# EAGLE design v5.3 (EAGLE 9.6.2)

## Sheet 1 of 5
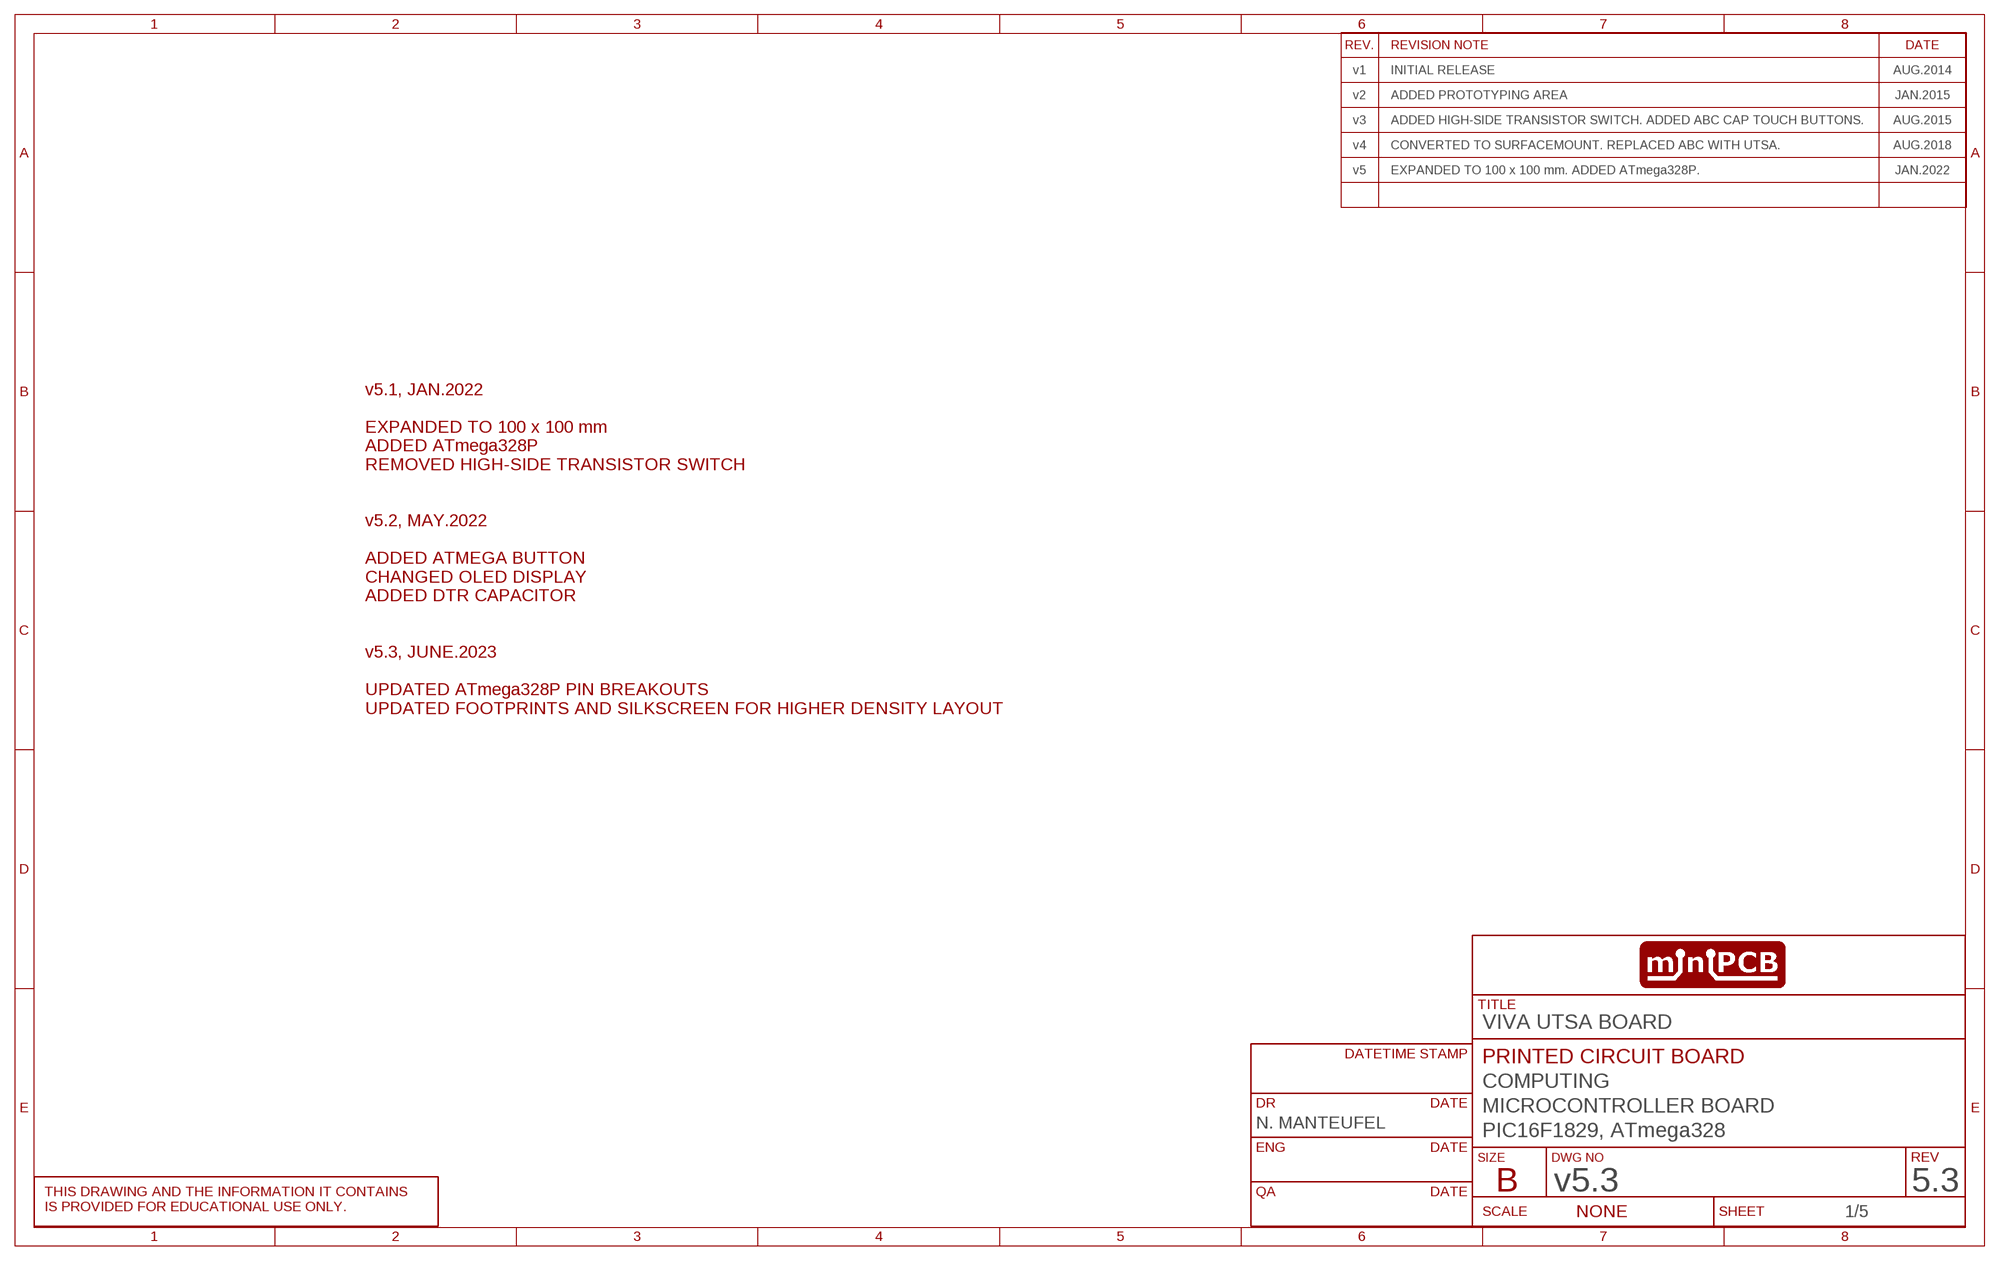
[diagram p0: schematic, sheet 1]
SHEET1 (SCHEMATIC): CIRCUIT_CATEGORY: COMPUTING; CIRCUIT_NAME: MICROCONTROLLER BOARD; CIRCUIT_VARIANT: PIC16F1829, ATmega328; DR: N. MANTEUFEL; PCB_PCBA: PRINTED CIRCUIT BOARD; REVA: A; REVISION: 5.3; TITLE: VIVA UTSA BOARD
U$6 (SCHEMATIC_VIVA): DRAWN_BY: N. MANTEUFEL; PROJECT: VIVA PIC16, UTSA; REVA: v1; REVA_DATE: AUG.2014; REVA_NOTE: INITIAL RELEASE; REVB: v2; REVB_DATE: JAN.2015; REVB_NOTE: ADDED PROTOTYPING AREA; REVC: v3; REVC_DATE: AUG.2015; REVC_NOTE: ADDED HIGH-SIDE TRANSISTOR SWITCH. ADDED ABC CAP TOUCH BUTTONS.; REVD: v4; REVD_DATE: AUG.2018; REVD_NOTE: CONVERTED TO SURFACEMOUNT. REPLACED ABC WITH UTSA.; REVE: v5; REVE_DATE: JAN.2022; REVE_NOTE: EXPANDED TO 100 x 100 mm. ADDED ATmega328P.; REVIEWED_BY: P. MORTON; REVISION: v5.3

### Notes on the sheet
- v5.1, JAN.2022
  
  EXPANDED TO 100 x 100 mm
  ADDED ATmega328P
  REMOVED HIGH-SIDE TRANSISTOR SWITCH
  
  
  v5.2, MAY.2022
  
  ADDED ATMEGA BUTTON
  CHANGED OLED DISPLAY
  ADDED DTR CAPACITOR
  
  
  v5.3, JUNE.2023
  
  UPDATED ATmega328P PIN BREAKOUTS
  UPDATED FOOTPRINTS AND SILKSCREEN FOR HIGHER DENSITY LAYOUT

## Sheet 2 of 5
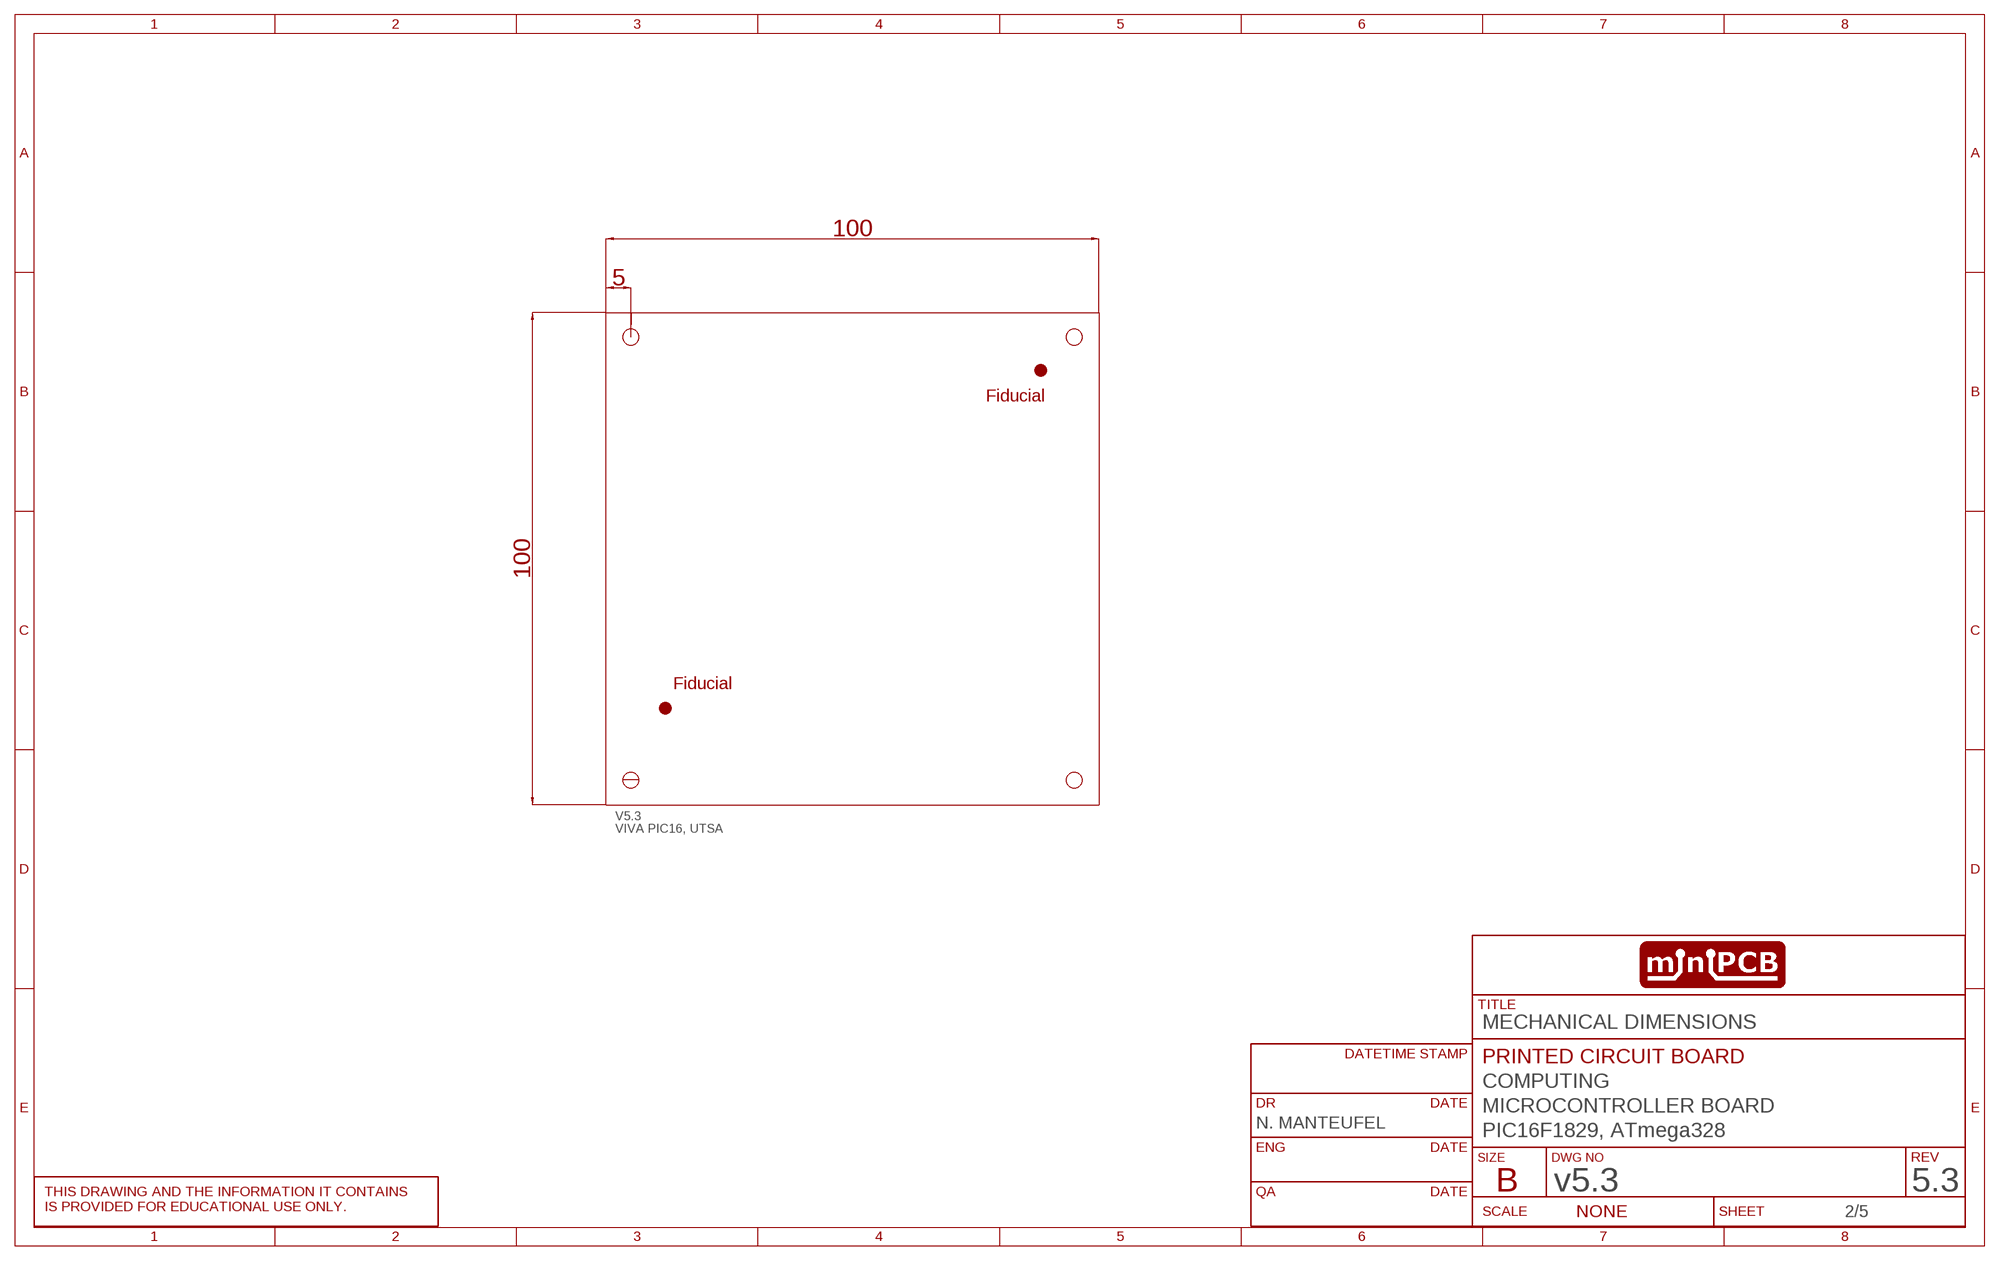
[diagram p1: schematic, sheet 2]
SHEET2 (SCHEMATIC): CIRCUIT_CATEGORY: COMPUTING; CIRCUIT_NAME: MICROCONTROLLER BOARD; CIRCUIT_VARIANT: PIC16F1829, ATmega328; DR: N. MANTEUFEL; PCB_PCBA: PRINTED CIRCUIT BOARD; REVA: A; REVISION: 5.3; TITLE: MECHANICAL DIMENSIONS

### Parts
A1  FIDUCIAL  [FIDUCIAL]
A2  FIDUCIAL  [FIDUCIAL]
V5.3  VIVA PIC16, UTSA  PCB_100X100  [PCB_100X100]

### Notes on the sheet
- Fiducial
- Fiducial

## Sheet 3 of 5
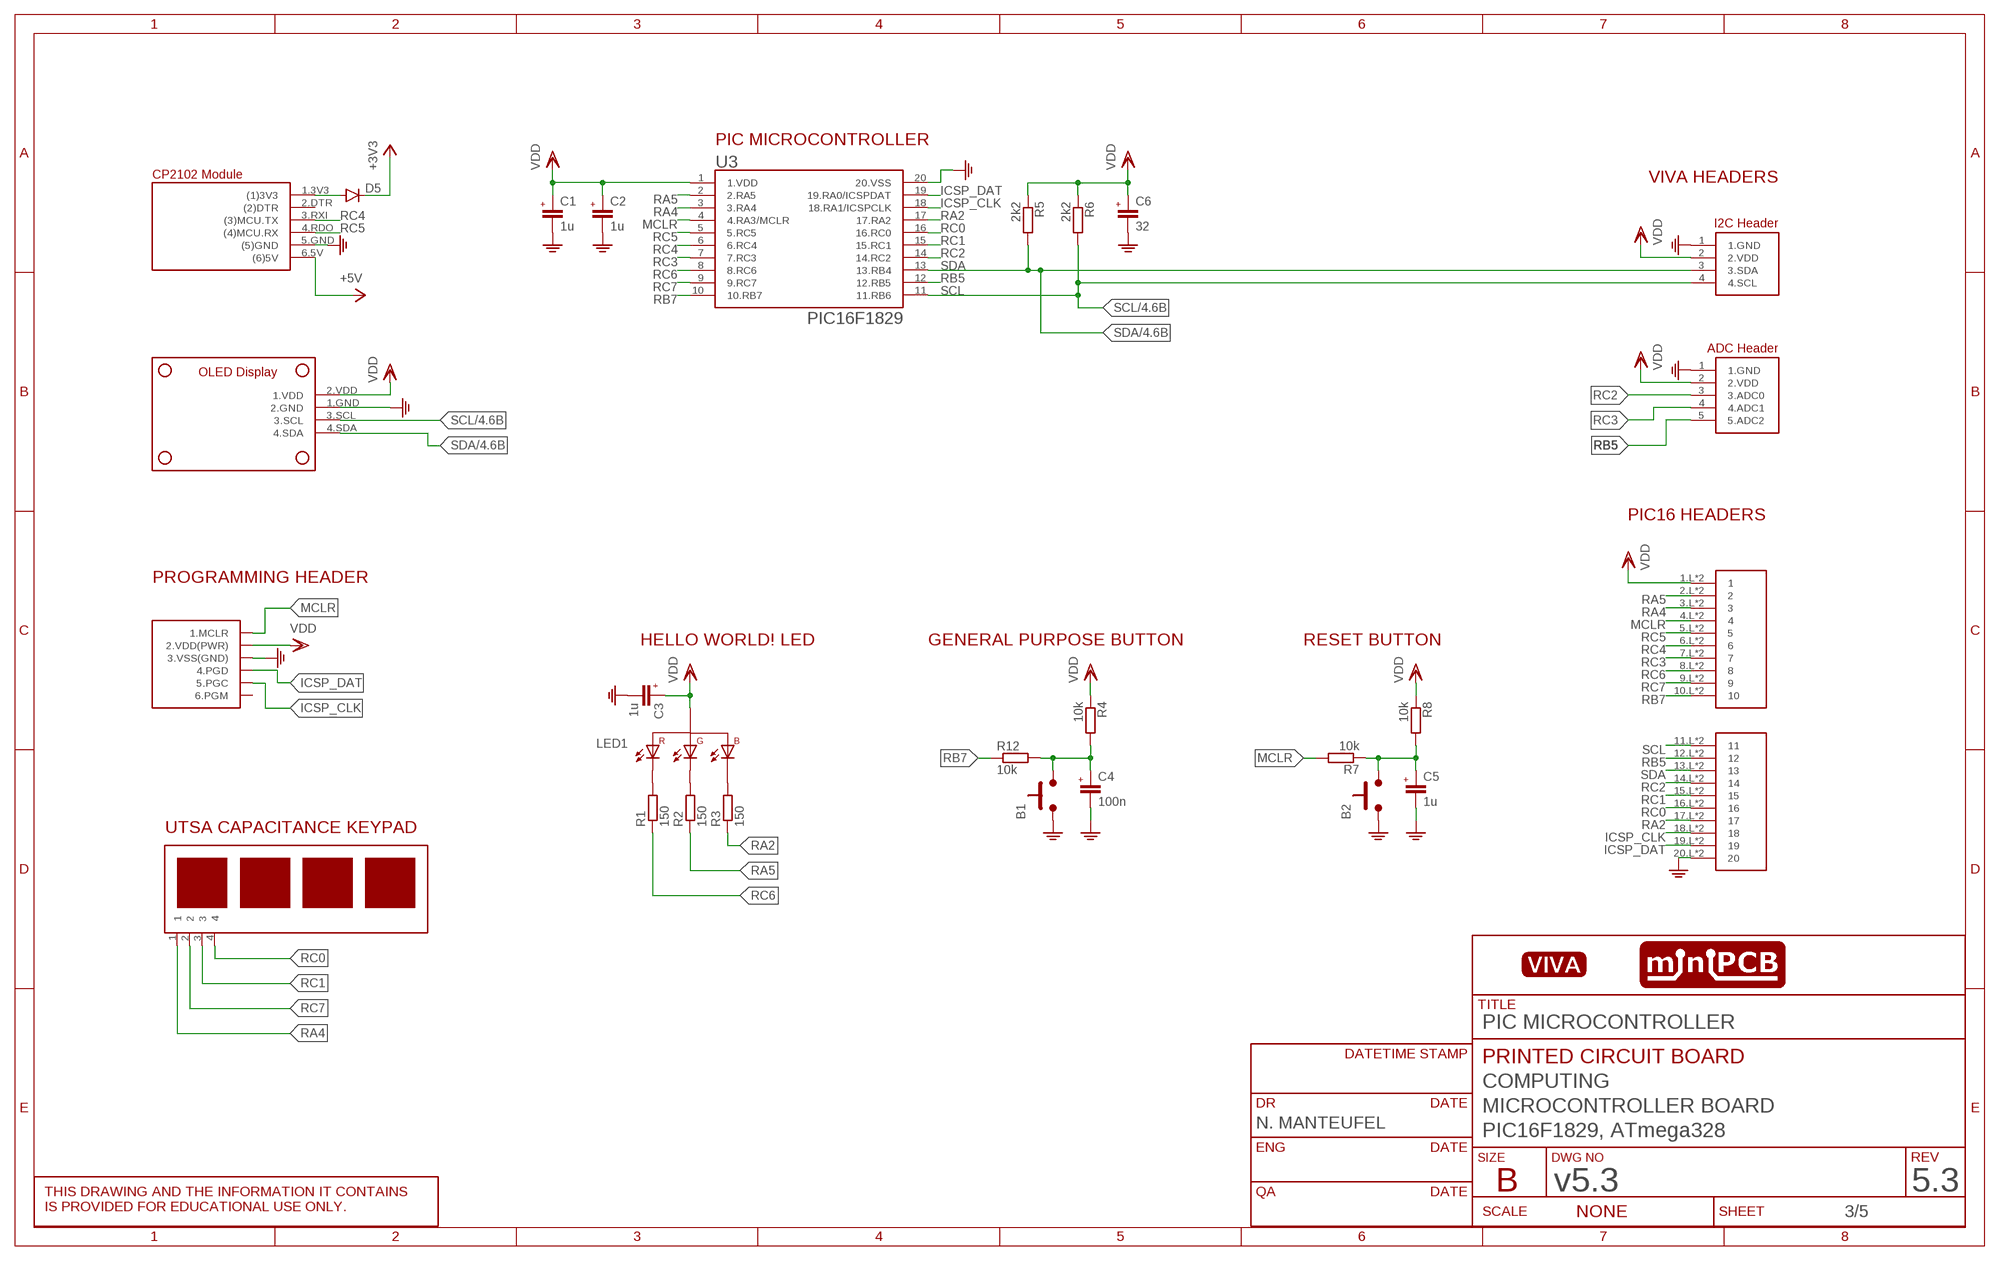
[diagram p2: schematic, sheet 3]
SHEET3 (SCHEMATIC): CIRCUIT_CATEGORY: COMPUTING; CIRCUIT_NAME: MICROCONTROLLER BOARD; CIRCUIT_VARIANT: PIC16F1829, ATmega328; DR: N. MANTEUFEL; PCB_PCBA: PRINTED CIRCUIT BOARD; REVA: A; REVISION: 5.3; TITLE: PIC MICROCONTROLLER

### Parts
B1  PUSHBUTTON6X6MM  [6X6MM]
B2  PUSHBUTTON6X6MM  [6X6MM]
C1  1u  C0805  [C0805]
C2  1u  C0805  [C0805]
C3  1u  C0805  [C0805]
C4  100n  C0805  [C0805]
C5  1u  C0805  [C0805]
C6  32  C0805  [C0805]
D5  DIODE-DO214AC  [DO214AC]
J4  PICKIT3  [PICKIT3]
J5  VIVA-HEADER-ADC-PIC16  [VIVA-HEADER-ADC-PIC16]
LED1  LED_RGBLTST-C19FD1WT  [0805_RGB]
R1  150  R-EU__R0805  [R0805]
R2  150  R-EU__R0805  [R0805]
R3  150  R-EU__R0805  [R0805]
R4  10k  R-EU__R0805  [R0805]
R5  2k2  R-EU__R0805  [R0805]
R6  2k2  R-EU__R0805  [R0805]
R7  10k  R-EU__R0805  [R0805]
R8  10k  R-EU__R0805  [R0805]
R12  10k  R-EU__R0805  [R0805]
U1  VIVA_UTSA-KEYPADV5  [VIVA_UTSA-KEYPAD-V5]
U2  VIVA_USB-TTL  [VIVA_USB_TTL_SUBTEXT]
U3  PIC16F1829  PIC16F1829300  [SOP20-NEW]
U4  VIVA-HEADER-I2C-RA  [VIVA-HEADER-I2C-RA]
U5  VIVA_PIC16BOARD  [VIVA_PIC16]
U$2  VIVA_LOGO  [VIVA_LOGO]
U$3  VIVA_OLEDGND  [VIVA_OLED-I2C-ALT]

### Nets
+3V3: D5.C ; also sheet 4,5
+5V: U2.6.5V((6)5V) ; also sheet 4,5
B1-CAP: B1.3.B B1.4.B C4.1(+) R4.2 R12.2
GND: B1.1.A B1.2.A B2.1.A B2.2.A C1.2(-) C2.2(-) C3.2(-) C4.2(-) C5.2(-) C6.2(-) J4.3(3.VSS(GND)) J5.1(1.GND) U2.5.GND((5)GND) U3.20(20.VSS) U4.1(1.GND) U5.20.L U5.20.R U$3.1.GND(2.GND) ; also sheet 4,5
ICSP_CLK: J4.5(5.PGC) U3.18(18.RA1/ICSPCLK) U5.18.L U5.18.R
ICSP_DAT: J4.4(4.PGD) U3.19(19.RA0/ICSPDAT) U5.19.L U5.19.R
MCLR: J4.1(1.MCLR) R7.2 U3.4(4.RA3/MCLR) U5.4.L U5.4.R
MCLR_CAP: B2.3.B B2.4.B C5.1(+) R7.1 R8.2
N$4: LED1.2(1.R-) R1.2
N$5: LED1.3(2.G-) R2.2
N$6: LED1.1(4.B-) R3.2
N$51: D5.A U2.1.3V3((1)3V3)
RA2: R3.1 U3.17(17.RA2) U5.17.L U5.17.R
RA4: U1.1 U3.3(3.RA4) U5.3.L U5.3.R
RA5: R2.1 U3.2(2.RA5) U5.2.L U5.2.R
RB5: J5.5(5.ADC2) U3.12(12.RB5) U5.12.L U5.12.R
RB7: R12.1 U3.10(10.RB7) U5.10.L U5.10.R
RC0: U1.4 U3.16(16.RC0) U5.16.L U5.16.R
RC1: U1.3 U3.15(15.RC1) U5.15.L U5.15.R
RC2: J5.3(3.ADC0) U3.14(14.RC2) U5.14.L U5.14.R
RC3: J5.4(4.ADC1) U3.7(7.RC3) U5.7.L U5.7.R
RC4: U2.3.RXI((3)MCU.TX) U3.6(6.RC4) U5.6.L U5.6.R
RC5: U2.4.RDO((4)MCU.RX) U3.5(5.RC5) U5.5.L U5.5.R
RC6: R1.1 U3.8(8.RC6) U5.8.L U5.8.R
RC7: U1.2 U3.9(9.RC7) U5.9.L U5.9.R
SCL: R6.2 U3.11(11.RB6) U4.4(4.SCL) U5.11.L U5.11.R U$3.3.SCL ; also sheet 4
SDA: R5.2 U3.13(13.RB4) U4.3(3.SDA) U5.13.L U5.13.R U$3.4.SDA ; also sheet 4
VDD: C1.1(+) C2.1(+) C3.1(+) C6.1(+) J4.2(2.VDD(PWR)) J5.2(2.VDD) LED1.4(3.+) R4.1 R5.1 R6.1 R8.1 U3.1(1.VDD) U4.2(2.VDD) U5.1.L U5.1.R U$3.2.VDD(1.VDD) ; also sheet 4,5
Unconnected: J4.6(6.PGM) U2.2.DTR((2)DTR)

### Notes on the sheet
- PIC MICROCONTROLLER
- VIVA HEADERS
- PIC16 HEADERS
- PROGRAMMING HEADER
- HELLO WORLD! LED | GENERAL PURPOSE BUTTON | RESET BUTTON
- UTSA CAPACITANCE KEYPAD

## Sheet 4 of 5
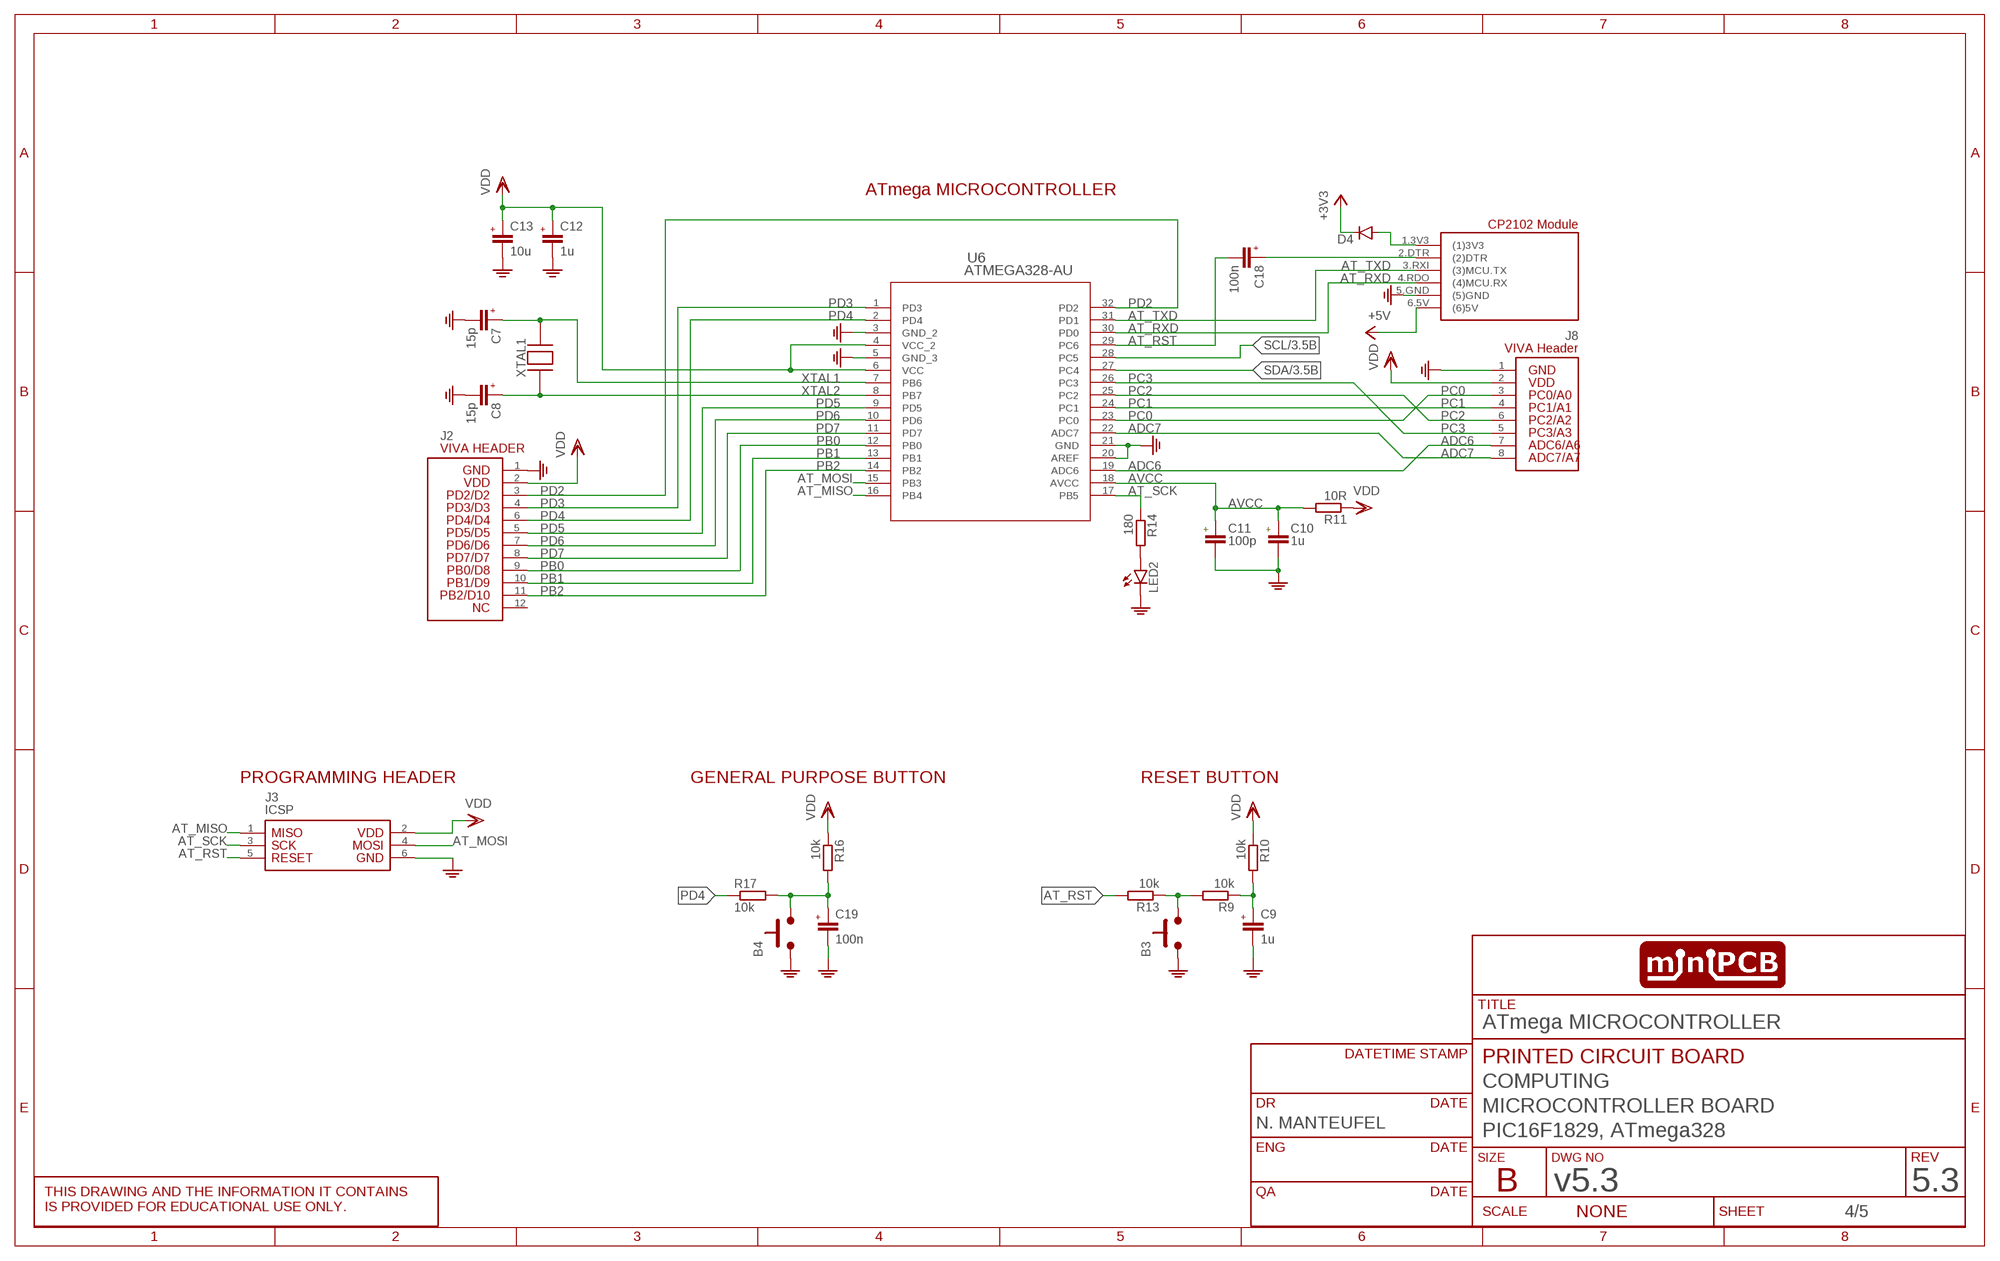
[diagram p3: schematic, sheet 4]
SHEET4 (SCHEMATIC): CIRCUIT_CATEGORY: COMPUTING; CIRCUIT_NAME: MICROCONTROLLER BOARD; CIRCUIT_VARIANT: PIC16F1829, ATmega328; DR: N. MANTEUFEL; PCB_PCBA: PRINTED CIRCUIT BOARD; REVA: A; REVISION: 5.3; TITLE: ATmega MICROCONTROLLER

### Parts
B3  PUSHBUTTON6X6MM  [6X6MM]
B4  PUSHBUTTON6X6MM  [6X6MM]
C7  15p  C0603  [C0603]
C8  15p  C0603  [C0603]
C9  1u  C0805  [C0805]
C10  1u  C-EU_C0805  [C0805]
C11  100p  C-EU_C0805  [C0805]
C12  1u  C0805  [C0805]
C13  10u  C0805  [C0805]
C18  100n  C0805  [C0805]
C19  100n  C0805  [C0805]
D4  DIODE-DO214AC  [DO214AC]
J2  VIVA-HEADER-12P  [VIVA-HEADER-12P]
J3  ICSP  PINS_6-2X3_AT  [PINS_6-2X3_AT]
J8  VIVA-HEADER-ADC-8P  [VIVA-HEADER-ADC-8P]
LED2  LEDSML0805  [SML0805]
R9  10k  R-EU__R0805  [R0805]
R10  10k  R-EU__R0805  [R0805]
R11  10R  R-EU__R0805  [R0805]
R13  10k  R-EU__R0805  [R0805]
R14  180  R-EU__R0805  [R0805]
R16  10k  R-EU__R0805  [R0805]
R17  10k  R-EU__R0805  [R0805]
U6  ATMEGA328-AU  [32A_ATM]
U7  VIVA_USB-TTL  [VIVA_USB_TTL_SUBTEXT]
XTAL1  CRYSTAL-3225_4P  [TXC7M2]

### Nets
+3V3: D4.C ; also sheet 3,5
+5V: U7.6.5V((6)5V) ; also sheet 3,5
ADC6: J8.7(5.ADC3) U6.19(ADC6)
ADC7: J8.8(5.ADC4) U6.22(ADC7)
AT_MISO: J3.1 U6.16(PB4)
AT_MOSI: J3.4 U6.15(PB3)
AT_RST: C18.2(-) J3.5 R13.2 U6.29(PC6)
AT_RST_BTN: B3.3.B B3.4.B R9.2 R13.1
AT_RST_CAP: C9.1(+) R9.1 R10.2
AT_RXD: U6.30(PD0) U7.4.RDO((4)MCU.RX)
AT_SCK: J3.3 R14.1 U6.17(PB5)
AT_TXD: U6.31(PD1) U7.3.RXI((3)MCU.TX)
AVCC: C10.1 C11.1 R11.2 U6.18(AVCC)
GND: B3.1.A B3.2.A B4.1.A B4.2.A C7.1(-) C8.1(-) C9.2(-) C10.2 C11.2 C12.2(-) C13.2(-) C19.2(-) J2.1(1.GND) J3.6 J8.1(1.GND) LED2.C U6.3(GND_2) U6.5(GND_3) U6.20(AREF) U6.21(GND) U7.5.GND((5)GND) ; also sheet 3,5
N$37: LED2.A R14.2
N$45: C18.1(+) U7.2.DTR((2)DTR)
N$48: D4.A U7.1.3V3((1)3V3)
PB0: J2.9(5.ADC5) U6.12(PB0)
PB1: J2.10(5.ADC6) U6.13(PB1)
PB2: J2.11(5.ADC7) U6.14(PB2)
PC0: J8.3(3.ADC0) U6.23(PC0)
PC1: J8.4(4.ADC1) U6.24(PC1)
PC2: J8.6(5.ADC2) U6.25(PC2)
PC3: J8.5(5.ADC1) U6.26(PC3)
PD2: J2.3(3.ADC0) U6.32(PD2)
PD3: J2.4(4.ADC1) U6.1(PD3)
PD4: J2.6(5.ADC2) R17.1 U6.2(PD4)
PD4-CAP: B4.3.B B4.4.B C19.1(+) R16.2 R17.2
PD5: J2.5(5.ADC1) U6.9(PD5)
PD6: J2.7(5.ADC3) U6.10(PD6)
PD7: J2.8(5.ADC4) U6.11(PD7)
SCL: U6.28(PC5) ; also sheet 3
SDA: U6.27(PC4) ; also sheet 3
VDD: C12.1(+) C13.1(+) J2.2(2.VDD) J3.2 J8.2(2.VDD) R10.1 R11.1 R16.1 U6.4(VCC_2) U6.6(VCC) ; also sheet 3,5
XTAL1: C7.2(+) U6.7(PB6) XTAL1.3
XTAL2: C8.2(+) U6.8(PB7) XTAL1.1
Unconnected: J2.12(5.ADC8)

### Notes on the sheet
- ATmega MICROCONTROLLER
- PROGRAMMING HEADER | GENERAL PURPOSE BUTTON | RESET BUTTON

## Sheet 5 of 5
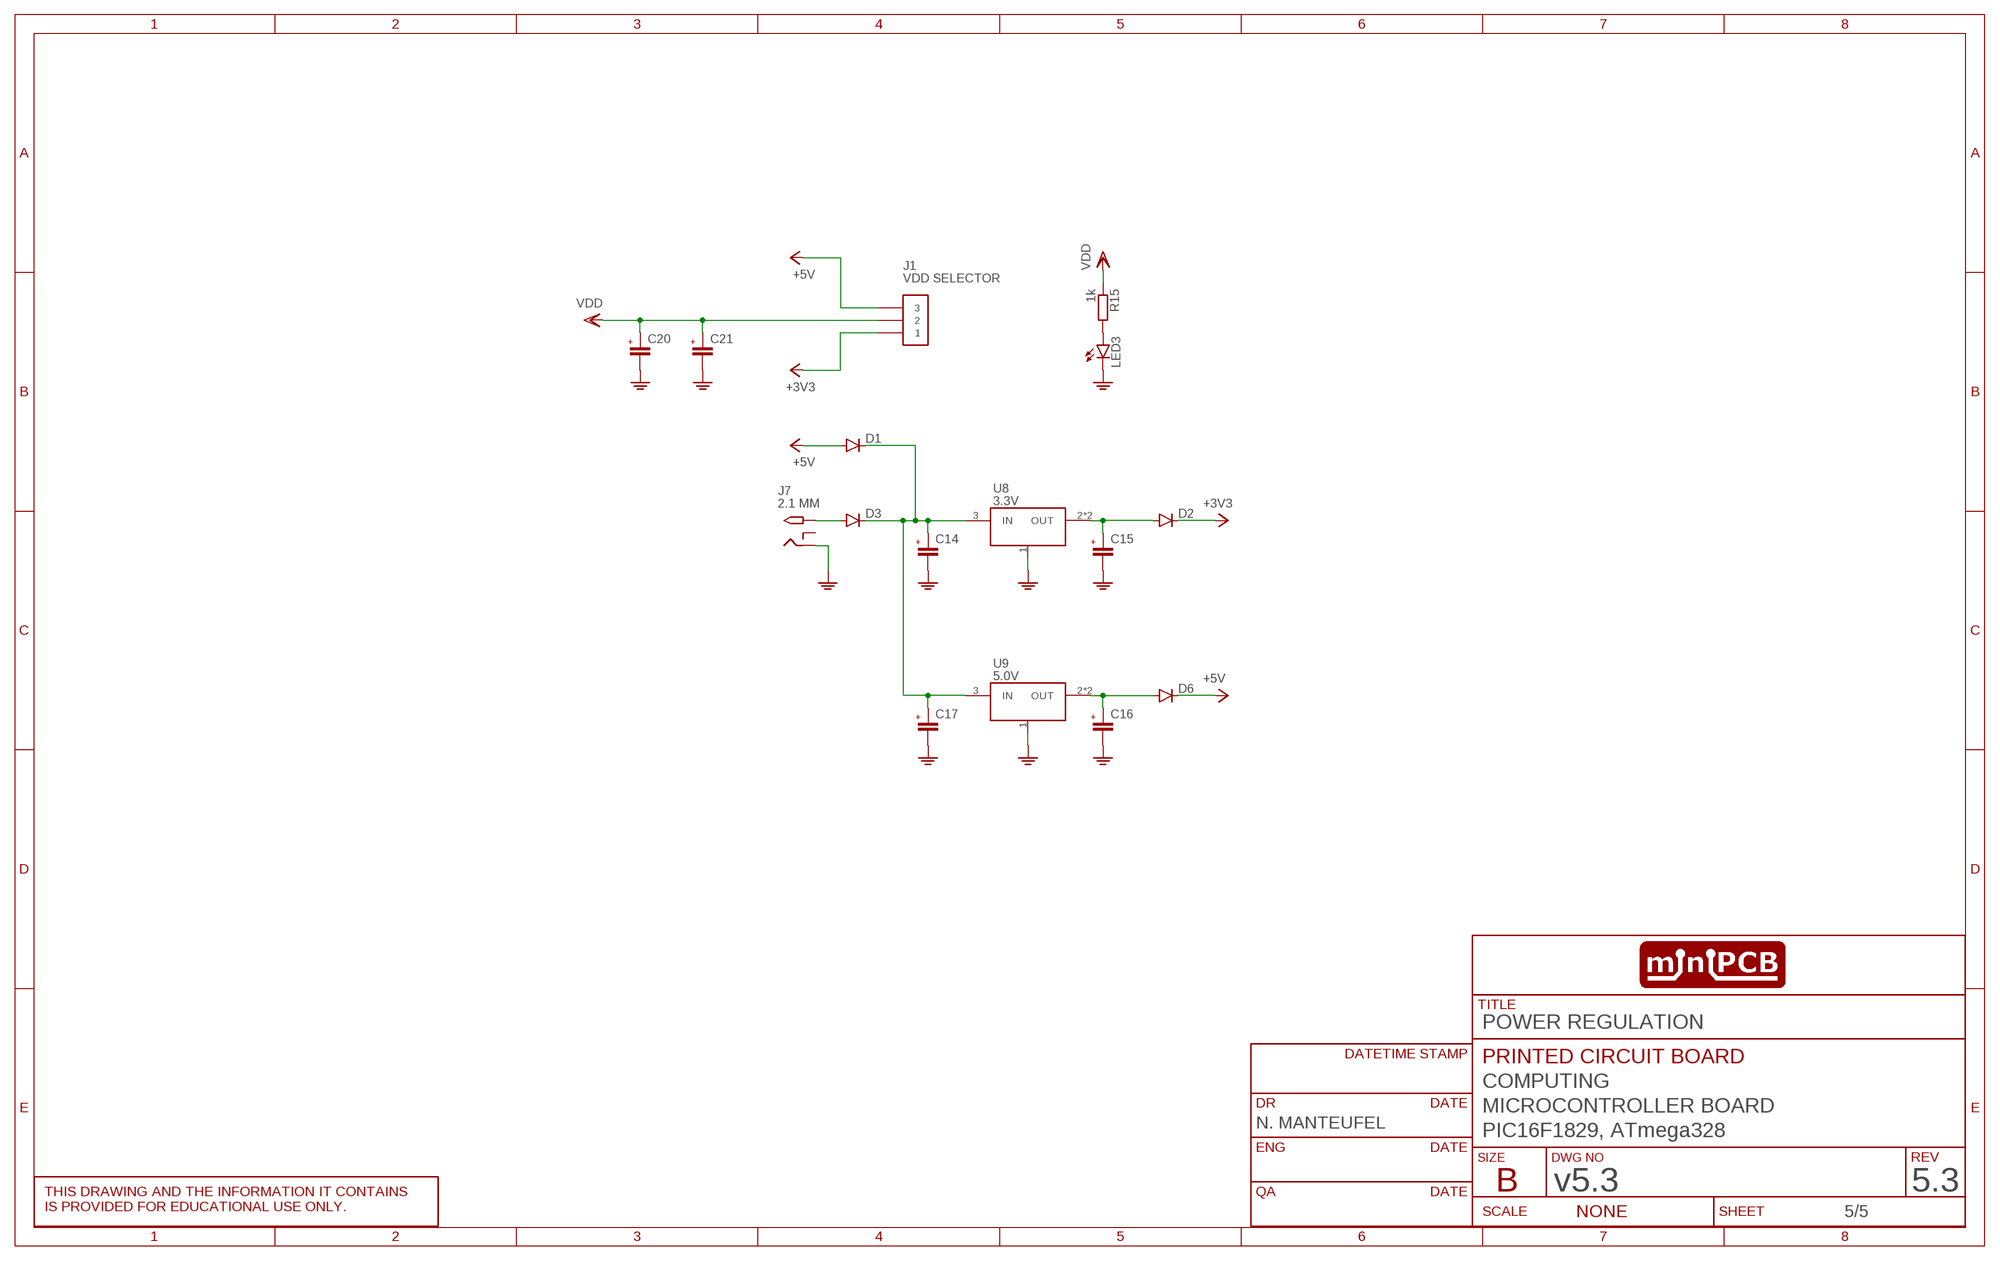
[diagram p4: schematic, sheet 5]
SHEET5 (SCHEMATIC): CIRCUIT_CATEGORY: COMPUTING; CIRCUIT_NAME: MICROCONTROLLER BOARD; CIRCUIT_VARIANT: PIC16F1829, ATmega328; DR: N. MANTEUFEL; PCB_PCBA: PRINTED CIRCUIT BOARD; REVA: A; REVISION: 5.3; TITLE: POWER REGULATION

### Parts
C14  C0805  [C0805]
C15  C0805  [C0805]
C16  C0805  [C0805]
C17  C0805  [C0805]
C20  C0805  [C0805]
C21  C0805  [C0805]
D1  DIODE-DO214AC  [DO214AC]
D2  DIODE-DO214AC  [DO214AC]
D3  DIODE-DO214AC  [DO214AC]
D6  DIODE-DO214AC  [DO214AC]
J1  VDD SELECTOR  PINS_3_2.54  [PINS_3]
J7  2.1 MM  2.1MMJACKTHM  [PJ-102A]
LED3  LEDSML0805  [SML0805]
R15  1k  R-EU__R0805  [R0805]
U8  3.3V  REGULATOR_SCHLM1117  [SOT223]
U9  5.0V  REGULATOR_SCHLM1117  [SOT223]

### Nets
+3V3: D2.C J1.1 ; also sheet 3,4
+5V: D1.A D6.C J1.3 ; also sheet 3,4
GND: C14.2(-) C15.2(-) C16.2(-) C17.2(-) C20.2(-) C21.2(-) J7.RING LED3.C U8.1(GND) U9.1(GND) ; also sheet 3,4
N$36: C14.1(+) C17.1(+) D1.C D3.C U8.3(IN) U9.3(IN)
N$38: LED3.A R15.2
N$46: C15.1(+) D2.A U8.2(OUT) U8.4.TAB(OUT)
N$47: D3.A J7.TIP
N$49: C16.1(+) D6.A U9.2(OUT) U9.4.TAB(OUT)
VDD: C20.1(+) C21.1(+) J1.2 R15.1 ; also sheet 3,4
Unconnected: J7.RING_SW

## Library data of the parts
A1 A2 = utsa:FIDUCIAL
B1-B4 = nolan-utsa:PUSHBUTTON: Tactile push button switch
C1-C9 C12-C21 = utsa:C
C10 C11 = utsa:C-EU: CAPACITOR, European symbol
D1-D6 = utsa:DIODE-: DIODE
J1 = utsa:PINS_3
J2 = utsa:VIVA-HEADER-12P; P10: PB1/D9; P11: PB2/D10; P12: NC; P3: PD2/D2; P4: PD3/D3; P5: PD4/D4; P6: PD5/D5; P7: PD6/D6; P8: PD7/D7; P9: PB0/D8
J3 = utsa:PINS_6-2X3_AT; P1: MISO; P2: VDD; P3: SCK; P4: MOSI; P5: RESET; P6: GND
J4 = nolan-viva:PICKIT3
J5 = utsa:VIVA-HEADER-ADC
J7 = utsa:2.1MMJACK: 2.1mm x 5.5mm THM DC jack with internal switch. Digikey part #PJ-102A, 4UCON part #05537 2.1mm x 5.5mm SMT DC jack with internal switch. Digikey part #PJ-002A-SMT, 4UCON part #03267 By microbuilder.eu & adafruit.com
J8 = utsa:VIVA-HEADER-ADC-8P; P3: PC0/A0; P4: PC1/A1; P5: PC2/A2; P6: PC3/A3; P7: ADC6/A6; P8: ADC7/A7
LED1 = utsa:LED_RGB
LED2 LED3 = utsa:LED: LED OSRAM: - CHIPLED LG R971, LG N971, LY N971, LG Q971, LY Q971, LO R971, LY R971 LH N974, LH R974 LS Q976, LO Q976, LY Q976 LO Q996 - Hyper CHIPLED LW Q18S LB Q993, LB Q99A, LB R99A - SideLED LS A670, LO A670, LY A670, LG A670, LP A670 LB A673, LV A673, LT A673, LW A673 LH A674 LY A675 LS A676, LA A676, LO A676, LY A676, LW A676 LS A679, LY A679, LG A679 - Hyper Micro SIDELED® LS Y876, LA Y876, LO Y876, LY Y876 LT Y87S - SmartLED LW L88C, LW L88S LB L89C, LB L89S, LG L890 LS L89K, LO L89K, LY L89K LS L896, LA L896, LO L896, LY L896 - TOPLED LS T670, LO T670, LY T670, LG T670, LP T670 LSG T670, LSP T670, LSY T670, LOP T670, LYG T670 LG T671, LOG T671, LSG T671 LB T673, LV T673, LT T673, LW T673 LH T674 LS T676, LA T676, LO T676, LY T676, LB T676, LH T676, LSB T676, LW T676 LB T67C, LV T67C, LT T67C, LS T67K, LO T67K, LY T67K, LW E67C LS E67B, LA E67B, LO E67B, LY E67B, LB E67C, LV E67C, LT E67C LW T67C LS T679, LY T679, LG T679 LS T770, LO T770, LY T770, LG T770, LP T770 LB T773, LV T773, LT T773, LW T773 LH T774 LS E675, LA E675, LY E675, LS T675 LS T776, LA T776, LO T776, LY T776, LB T776 LHGB T686 LT T68C, LB T68C - Hyper Mini TOPLED® LB M676 - Mini TOPLED Santana® LG M470 LS M47K, LO M47K, LY M47K Source: http://www.osram.convergy.de LUXEON: - LUMILED® LXK2-PW12-R00, LXK2-PW12-S00, LXK2-PW14-U00, LXK2-PW14-V00 LXK2-PM12-R00, LXK2-PM12-S00, LXK2-PM14-U00 LXK2-PE12-Q00, LXK2-PE12-R00, LXK2-PE12-S00, LXK2-PE14-T00, LXK2-PE14-U00 LXK2-PB12-K00, LXK2-PB12-L00, LXK2-PB12-M00, LXK2-PB14-N00, LXK2-PB14-P00, LXK2-PB14-Q00 LXK2-PR12-L00, LXK2-PR12-M00, LXK2-PR14-Q00, LXK2-PR14-R00 LXK2-PD12-Q00, LXK2-PD12-R00, LXK2-PD12-S00 LXK2-PH12-R00, LXK2-PH12-S00 LXK2-PL12-P00, LXK2-PL12-Q00, LXK2-PL12-R00 Source: www.luxeon.com KINGBRIGHT: KA-3528ASYC Source: www.kingbright.com
R1-R17 = utsa:R-EU_: RESISTOR, European symbol
U1 = utsa:VIVA_UTSA-KEYPAD
U2 U7 = utsa:VIVA_USB-TTL
U3 = utsa:PIC16F1829
U4 = utsa:VIVA-HEADER-I2C
U5 = utsa:VIVA_PIC16
U6 = utsa:ATMEGA328-AU; COPYRIGHT: Copyright (C) 2021 Ultra Librarian. All rights reserved.; MANUFACTURER_PART_NUMBER: ATMEGA328-AU; MFR_NAME: Microchip
U8 U9 = utsa:REGULATOR_SCH: Linear Regulator in SOT-223 package. NOTE: select correct pinout for your application. Tab may be OUT or GND!
U$2 = utsa:VIVA_LOGO
U$3 = utsa:VIVA_OLED
V5.3 = utsa:PCB_100X100
XTAL1 = utsa:CRYSTAL: HC49S Crystal Oscillator

## Board
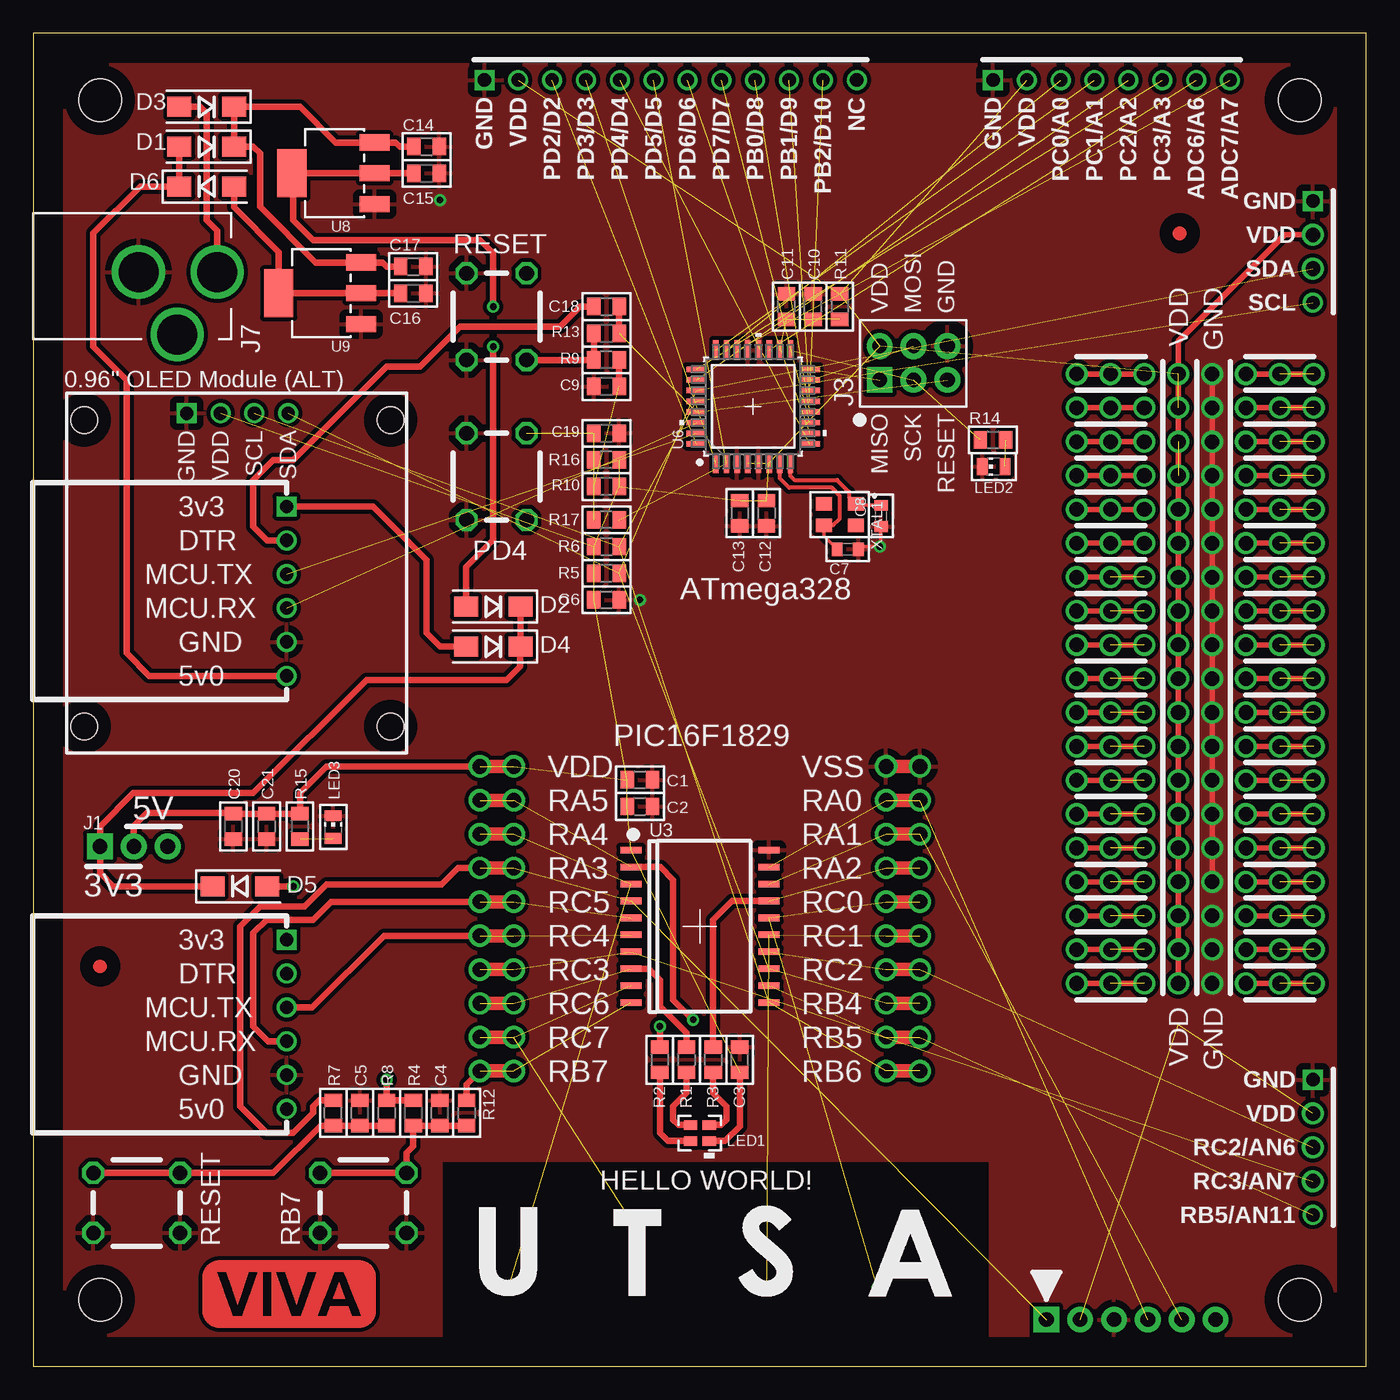
[diagram p5: board, top side]
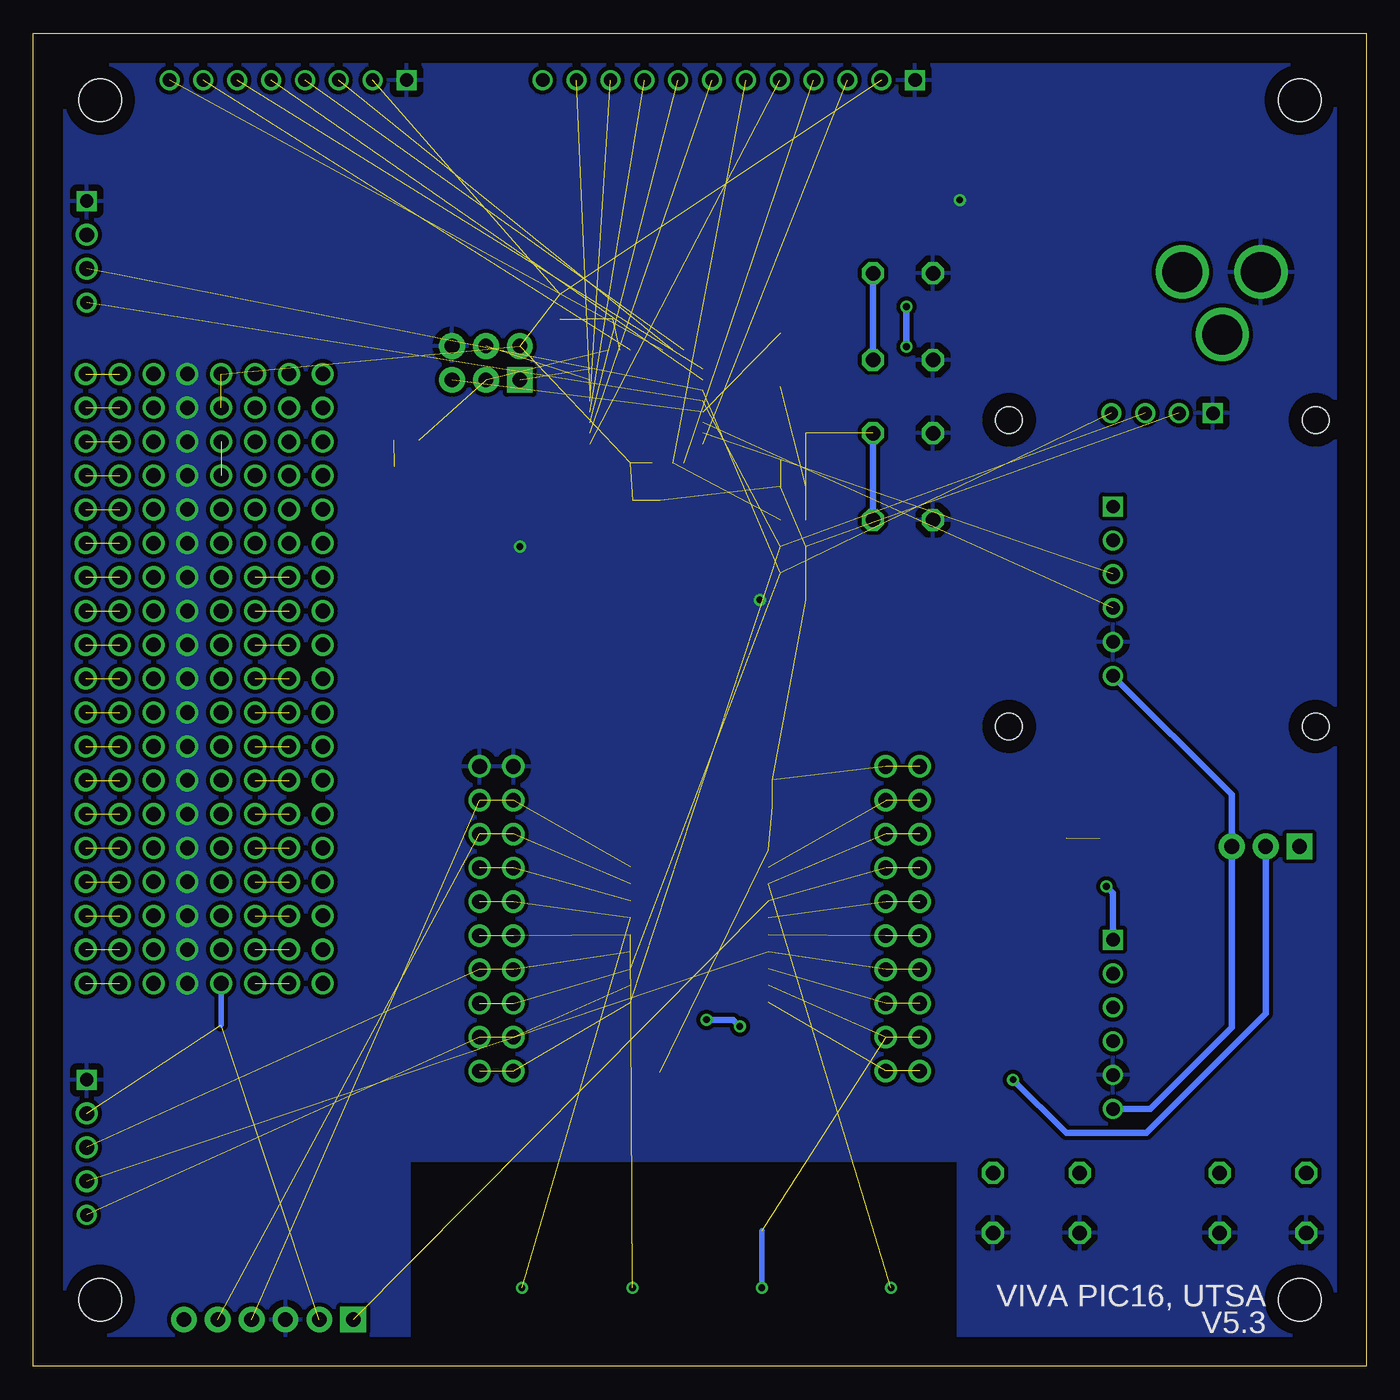
[diagram p6: board, bottom side, seen from below]

Size 100 x 100 mm. Coordinates in mm from the lower left corner, seen from the top.
Copper layers (1+2*15+16): Top 0.035mm / dielectric 0.15mm / Route2 0.035mm / dielectric 0.15mm / Route15 0.035mm / dielectric 0.2mm / Bottom 0.035mm
Design rules "minipcb-SMD": minimum track width 0.25mm, minimum drill 0.5mm, track to track 0.3mm, track to pad 0.3mm, pad to pad 0.15mm, via to via 0.3mm, smd to smd 0.15mm, copper to edge 1mm, drill to drill 1mm, minimum pad ring 0.2mm, minimum via ring 0.2mm, stop-mask expansion 0.1mm, vias tented up to drill 0.55mm, thermal gap 0.5mm
tRestrict: area 66.7,74.7 to 70.3,78.3; area 79.4,1.4 to 82.6,4.6

### Footprints (pad centres in the part's own frame; a part is rotated, then mirrored left to right if it is on the bottom)
FIDUCIAL = smd 0 x 0: FIDUCIAL 0,0
6X6MM = drill 1.1 octagon: 1.A 0,0; 2.A 6.5,0; 3.B 0,4.5; 4.B 6.5,4.5
C0805 = smd 1 x 1.3: 1 -0.95,0; 2 0.95,0
C0603 = smd 0.8 x 1: 1 -0.8,0; 2 0.8,0
DO214AC = smd 1.8 x 1.5: A 2.05,0; C -2.05,0
PINS_3 = drill 1.1 pad 1.93 square: 1 0,0 | drill 1.1 pad 1.93: 2 2.54,0; 3 5.08,0
VIVA-HEADER-12P = drill 1 square: 1 0,0 | drill 1: 2 2.54,0; 3 5.08,0; 4 7.62,0; 5 10.16,0; 6 12.7,0; 7 15.24,0; 8 17.78,0; 9 20.32,0; 10 22.86,0; 11 25.4,0; 12 27.94,0
PINS_6-2X3_AT = drill 1.1 pad 1.93 square: 1 0,0 | drill 1.1 pad 1.93: 2 2.54,0; 3 0,-2.54; 4 2.54,-2.54; 5 0,-5.08; 6 2.54,-5.08
PICKIT3 = drill 1.1 pad 1.93 square: 1 0,0 | drill 1.1 pad 1.93: 2 2.54,0; 3 5.08,0; 4 7.62,0; 5 10.16,0; 6 12.7,0
VIVA-HEADER-ADC-PIC16 = drill 1 square: 1 0,0 | drill 1.1: 2 2.54,0; 3 5.08,0; 4 7.62,0 | drill 1: 5 10.16,0
PJ-102A = drill 3 pad 4: RING 0.1,-3.39; RING_SW -4.6,-6.29; TIP 0.1,-9.29
VIVA-HEADER-ADC-8P = drill 1 square: 1 0,0 | drill 1: 2 2.54,0; 3 5.08,0; 4 7.62,0; 5 10.16,0; 6 12.7,0; 7 15.24,0; 8 17.78,0
0805_RGB = smd 1 x 0.7: 1 0.7,0.6; 2 -0.7,0.6; 3 -0.7,-0.6; 4 0.7,-0.6
SML0805 = smd 0.8 x 1.27: A -0.9,0; C 0.8,0
R0805 = smd 1 x 1.3: 1 -0.95,0; 2 0.95,0
VIVA_UTSA-KEYPAD-V5 = drill 0.5: 1 -14.36,4.38; 2 -4.66,4.38; 3 5.04,4.38; 4 13.34,4.38
VIVA_USB_TTL_SUBTEXT = drill 1 square: 1.3V3 0,0 | drill 1: 2.DTR 0,-2.54; 3.RXI 0,-5.08; 4.RDO 0,-7.62; 5.GND 0,-10.16; 6.5V 0,-12.7
SOP20-NEW = smd 0.5 x 1.6: 1 -5.715,-5.152; 2 -4.445,-5.152; 3 -3.175,-5.152; 4 -1.905,-5.152; 5 -0.635,-5.152; 6 0.635,-5.152; 7 1.905,-5.152; 8 3.175,-5.152; 9 4.445,-5.152; 10 5.715,-5.152; 11 5.715,5.188; 12 4.445,5.188; 13 3.175,5.188; 14 1.905,5.188; 15 0.635,5.188; 16 -0.635,5.188; 17 -1.905,5.188; 18 -3.175,5.188; 19 -4.445,5.188; 20 -5.715,5.188
VIVA-HEADER-I2C-RA = drill 1 square: 1 0,0 | drill 1.1: 2 2.54,0; 3 5.08,0 | drill 1: 4 7.62,0
VIVA_PIC16 = drill 1.1 pad 1.676: 1.L 0,0; 1.R 2.54,0; 2.L 0,-2.54; 2.R 2.54,-2.54; 3.L 0,-5.08; 3.R 2.54,-5.08; 4.L 0,-7.62; 4.R 2.54,-7.62; 5.L 0,-10.16; 5.R 2.54,-10.16; 6.L 0,-12.7; 6.R 2.54,-12.7; 7.L 0,-15.24; 7.R 2.54,-15.24; 8.L 0,-17.78; 8.R 2.54,-17.78; 9.L 0,-20.32; 9.R 2.54,-20.32; 10.L 0,-22.86; 10.R 2.54,-22.86; 11.L 30.48,-22.86; 11.R 33.02,-22.86; 12.L 30.48,-20.32; 12.R 33.02,-20.32; 13.L 30.48,-17.78; 13.R 33.02,-17.78; 14.L 30.48,-15.24; 14.R 33.02,-15.24; 15.L 30.48,-12.7; 15.R 33.02,-12.7; 16.L 30.48,-10.16; 16.R 33.02,-10.16; 17.L 30.48,-7.62; 17.R 33.02,-7.62; 18.L 30.48,-5.08; 18.R 33.02,-5.08; 19.L 30.48,-2.54; 19.R 33.02,-2.54; 20.L 30.48,0; 20.R 33.02,0
32A_ATM = smd 1.5 x 0.4: 1 -4.25,2.8; 2 -4.25,2; 3 -4.25,1.2; 4 -4.25,0.4; 5 -4.25,-0.4; 6 -4.25,-1.2; 7 -4.25,-2; 8 -4.25,-2.8; 17 4.25,-2.8; 18 4.25,-2; 19 4.25,-1.2; 20 4.25,-0.4; 21 4.25,0.4; 22 4.25,1.2; 23 4.25,2; 24 4.25,2.8 | smd 0.4 x 1.5: 9 -2.8,-4.25; 10 -2,-4.25; 11 -1.2,-4.25; 12 -0.4,-4.25; 13 0.4,-4.25; 14 1.2,-4.25; 15 2,-4.25; 16 2.8,-4.25; 25 2.8,4.25; 26 2,4.25; 27 1.2,4.25; 28 0.4,4.25; 29 -0.4,4.25; 30 -1.2,4.25; 31 -2,4.25; 32 -2.8,4.25
SOT223 = smd 1.219 x 2.235: 1 -2.311,-3.099; 2 0,-3.099; 3 2.311,-3.099 | smd 3.6 x 2.2: 4.TAB 0,3.099
VIVA_OLED-I2C-ALT = drill 1 square: 1.GND 0,0 | drill 1: 2.VDD 2.54,0; 3.SCL 5.08,0; 4.SDA 7.62,0 | hole 2: -7.7,-0.5; 15.3,-0.5; -7.7,-23.5; 15.3,-23.5
PCB_100X100 = hole 3.2: 5,95; 95,95; 95,5; 5,5
TXC7M2 = smd 1.2 x 1: 1 -1.2,-0.8; 2 1.2,-0.8; 3 1.2,0.8; 4 -1.2,0.8

### Placement (x,y rotation side)
A1  86,85 0 top
A2  5,30 0 top
B1  21.5,10 0 top
B2  4.5,10 0 top
B3  32.5,82 270 top
B4  32.5,70 270 top
C1  45.5,44 0 top
C2  45.5,42 0 top
C3  53,23 90 top
C4  30.5,19 90 top
C5  24.5,19 90 top
C6  43,57.5 0 top
C7  61.1,61.3 180 top
C8  63.6,63.8 90 top
C9  43,73.5 180 top
C10  58.5,79.5 90 top
C11  56.5,79.5 90 top
C12  55,64 270 top
C13  53,64 270 top
C14  29.5,91.5 0 top
C15  29.5,89.5 0 top
C16  28.5,80.5 0 top
C17  28.5,82.5 0 top
C18  43,79.5 0 top
C19  43,70 0 top
C20  15,40.5 270 top
C21  17.5,40.5 270 top
D1  13,91.5 180 top
D2  34.5,57 180 top
D3  13,94.5 180 top
D4  34.5,54 180 top
D5  15.5,36 0 top
D6  13,88.5 0 top
J1  5,39 0 top
J2  33.84,96.5 0 top
J3  63.5,74 90 top
J4  76,3.5 0 top
J5  96,21.5 270 top
J7  4.5,82 90 top
J8  72,96.5 0 top
LED1  50,17.5 0 top
LED2  72,67.5 180 top
LED3  22.5,40.5 90 top
R1  49,23 270 top
R2  47,23 270 top
R3  51,23 270 top
R4  28.5,19 270 top
R5  43,59.5 0 top
R6  43,61.5 0 top
R7  22.5,19 90 top
R8  26.5,19 270 top
R9  43,75.5 180 top
R10  43,66 180 top
R11  60.5,79.5 270 top
R12  32.5,19 270 top
R13  43,77.5 0 top
R14  72,69.5 0 top
R15  20,40.5 270 top
R16  43,68 180 top
R17  43,63.5 180 top
U1  50,1.5 0 top
U2  19,32 0 top
U3  50,33 270 top
U4  96,87.42 270 top
U5  33.5,45 0 top
U6  54,72 90 top
U7  19,64.5 0 top
U8  22.5,89.5 90 top
U9  21.5,80.5 90 top
U$2  12.7,2.9 0 top
U$3  11.5,71.5 0 top
V5.3  0,0 0 top
XTAL1  60.5,63.9 180 top

### Tracks (layer width: path | path; a pad name or v marks a point on that pad's centre or on a via)
+3V3
  Top 0.5: D5.C 6,36 5,37 J1.1 5,40.5 7.5,43 16.5,43 25,51.5 35.5,51.5 36.5,52.5 36.5,53.95 D4.C D2.C
+5V
  Top 0.5: D1.A D6.C 8,88.5 4.5,85 4.5,76.5 7,74 7,53.5 8.7,51.8 U7.6.5V
  Bottom 0.5: U7.6.5V 10.08,42.88 J1.3 10.08,25.42 16.2,19.3 U2.6.5V
ADC6  (1 unrouted)
ADC7  (1 unrouted)
AT_MISO  (1 unrouted)
AT_MOSI  (1 unrouted)
AT_RST  (2 unrouted)
  Top 0.5: C18.2 R13.2
AT_RST_BTN
  Top 0.5: B3.4.B R9.2 R13.1
  Bottom 0.5: B3.3.B B3.4.B
AT_RST_CAP  (1 unrouted)
  Top 0.5: C9.1 R9.1
AT_RXD  (1 unrouted)
AT_SCK  (2 unrouted)
AT_TXD  (1 unrouted)
AVCC  (3 unrouted)
B1-CAP
  Top 0.5: B1.3.B B1.4.B 28,16 28.5,16.5 R4.2 C4.1 R12.2
GND  (via drill 0.5, 1.1)
  Top 0.25: C7.1 62.1,61.5 v63.5,61.5 63.6,61.6 C8.1
  Top 0.406: v88.44,36.34 v88.44,74.44
  other vias: 88.44,71.9 88.44,69.36 88.44,66.82 88.44,64.28 88.44,61.74 88.44,59.2 88.44,56.66 88.44,54.12 88.44,51.58 88.44,49.04 88.44,46.5 88.44,43.96 88.44,41.42 88.44,38.88 30.5,87.5 45.5,57.5 88.44,33.8 88.44,31.26 88.44,28.72
  pour Top: 2,2 98,2 98,98 2,98
  pour Bottom: 2,2 98,2 98,98 2,98
ICSP_CLK  (3 unrouted)
ICSP_DAT  (3 unrouted)
MCLR  (3 unrouted)
  Top 0.5: R7.2 21.45,19.95 21,19.5 21,19 19.5,17.5 17.5,17.5 15.5,19.5 15.5,33 17,34.5 20.37,34.5 22.01,36.14 30.64,36.14 31.88,37.38 U5.4.L
MCLR_CAP
  Top 0.5: R8.2 C5.1 R7.1 21.55,18.05 18,14.5 B2.4.B B2.3.B
N$1  (via drill 1.1)  (1 unrouted)
  Top 0.406: v90.98,36.34 v96.06,36.34
  other vias: 93.52,36.34
N$2  (via drill 1.1)  (1 unrouted)
  Top 0.406: v90.98,38.88 v96.06,38.88
  other vias: 93.52,38.88
N$3  (via drill 1.1)  (1 unrouted)
  Top 0.406: v90.98,41.42 v96.06,41.42
  other vias: 93.52,41.42
N$4
  Top 0.5: LED1.2 48.4,18.1 48,18.5 48,19.5 49,20.5 R1.2
N$5
  Top 0.5: LED1.3 47.6,16.9 47,17.5 R2.2
N$6
  Top 0.5: LED1.1 51.6,18.1 52,18.5 52,19.5 51,20.5 R3.2
N$7  (via drill 1.1)  (1 unrouted)
  Top 0.406: v90.98,43.96 v96.06,43.96
  other vias: 93.52,43.96
N$8  (via drill 1.1)  (1 unrouted)
  Top 0.406: v90.98,46.5 v96.06,46.5
  other vias: 93.52,46.5
N$9  (via drill 1.1)  (1 unrouted)
  Top 0.406: v90.98,49.04 v96.06,49.04
  other vias: 93.52,49.04
N$10  (via drill 1.1)  (1 unrouted)
  Top 0.406: v90.98,51.58 v96.06,51.58
  other vias: 93.52,51.58
N$11  (via drill 1.1)  (1 unrouted)
  Top 0.406: v90.98,54.12 v96.06,54.12
  other vias: 93.52,54.12
N$12  (via drill 1.1)  (1 unrouted)
  Top 0.406: v90.98,56.66 v96.06,56.66
  other vias: 93.52,56.66
N$13  (via drill 1.1)  (1 unrouted)
  Top 0.406: v90.98,59.2 v96.06,59.2
  other vias: 93.52,59.2
N$14  (via drill 1.1)  (1 unrouted)
  Top 0.406: v90.98,61.74 v96.06,61.74
  other vias: 93.52,61.74
N$15  (via drill 1.1)  (1 unrouted)
  Top 0.406: v90.98,64.28 v96.06,64.28
  other vias: 93.52,64.28
N$16  (via drill 1.1)  (1 unrouted)
  Top 0.406: v90.98,66.82 v96.06,66.82
  other vias: 93.52,66.82
N$17  (via drill 1.1)  (1 unrouted)
  Top 0.406: v90.98,69.36 v96.06,69.36
  other vias: 93.52,69.36
N$18  (via drill 1.1)  (1 unrouted)
  Top 0.406: v90.98,71.9 v96.06,71.9
  other vias: 93.52,71.9
N$19  (via drill 1.1)  (1 unrouted)
  Top 0.406: v90.98,74.44 v96.06,74.44
  other vias: 93.52,74.44
N$20  (via drill 1.1)  (1 unrouted)
  Top 0.406: v78.28,36.34 v83.36,36.34
  other vias: 80.82,36.34
N$21  (via drill 1.1)  (1 unrouted)
  Top 0.406: v78.28,38.88 v83.36,38.88
  other vias: 80.82,38.88
N$22  (via drill 1.1)  (1 unrouted)
  Top 0.406: v78.28,41.42 v83.36,41.42
  other vias: 80.82,41.42
N$23  (via drill 1.1)  (1 unrouted)
  Top 0.406: v78.28,43.96 v83.36,43.96
  other vias: 80.82,43.96
N$24  (via drill 1.1)  (1 unrouted)
  Top 0.406: v78.28,46.5 v83.36,46.5
  other vias: 80.82,46.5
N$25  (via drill 1.1)  (1 unrouted)
  Top 0.406: v78.28,49.04 v83.36,49.04
  other vias: 80.82,49.04
N$26  (via drill 1.1)  (1 unrouted)
  Top 0.406: v78.28,51.58 v83.36,51.58
  other vias: 80.82,51.58
N$27  (via drill 1.1)  (1 unrouted)
  Top 0.406: v78.28,54.12 v83.36,54.12
  other vias: 80.82,54.12
N$28  (via drill 1.1)  (1 unrouted)
  Top 0.406: v78.28,56.66 v83.36,56.66
  other vias: 80.82,56.66
N$29  (via drill 1.1)  (1 unrouted)
  Top 0.406: v78.28,59.2 v83.36,59.2
  other vias: 80.82,59.2
N$30  (via drill 1.1)
  Top 0.406: v78.28,61.74 v80.82,61.74 v83.36,61.74
N$31  (via drill 1.1)
  Top 0.406: v78.28,64.28 v80.82,64.28 v83.36,64.28
N$32  (via drill 1.1)
  Top 0.406: v78.28,66.82 v80.82,66.82 v83.36,66.82
N$33  (via drill 1.1)
  Top 0.406: v78.28,69.36 v80.82,69.36 v83.36,69.36
N$34  (via drill 1.1)
  Top 0.406: v78.28,71.9 v80.82,71.9 v83.36,71.9
N$35  (via drill 1.1)
  Top 0.406: v78.28,74.44 v80.82,74.44 v83.36,74.44
N$36
  Top 0.5: C14.1 27.5,91.5 27.19,91.81 U8.3 22.69,91.81 20,94.5 D3.C D1.C 16.5,91.5 17,91 17,87 21.19,82.81 U9.3 26.19,82.81 26.5,82.5 C17.1
N$37  (1 unrouted)
N$38  (1 unrouted)
N$39  (via drill 1.1)  (1 unrouted)
  Top 0.406: v78.28,28.72 v83.36,28.72
  other vias: 80.82,28.72
N$40  (via drill 1.1)  (1 unrouted)
  Top 0.406: v78.28,31.26 v83.36,31.26
  other vias: 80.82,31.26
N$41  (via drill 1.1)  (1 unrouted)
  Top 0.406: v78.28,33.8 v83.36,33.8
  other vias: 80.82,33.8
N$42  (via drill 1.1)  (1 unrouted)
  Top 0.406: v90.98,28.72 v96.06,28.72
  other vias: 93.52,28.72
N$43  (via drill 1.1)  (1 unrouted)
  Top 0.406: v90.98,31.26 v96.06,31.26
  other vias: 93.52,31.26
N$44  (via drill 1.1)  (1 unrouted)
  Top 0.406: v90.98,33.8 v96.06,33.8
  other vias: 93.52,33.8
N$45
  Top 0.5: U7.2.DTR 17.54,61.96 16.5,63 16.5,66.5 18,68 19.5,68 26.5,75 29,75 32,78 39.5,78 41,79.5 C18.1
N$46  (via drill 0.5)
  Top 0.5: C15.1 U8.2 U8.4.TAB 19.5,89.4 19.5,86 21,84.5 33.5,84.5 34.5,83.5 v34.5,79.5 | D2.A 32.45,59.95 34.5,62 v34.5,76.5
  Bottom 0.5: v34.5,76.5 v34.5,79.5
N$47
  Top 0.5: D3.A 12.5,94.5 13,94 13,86 13.79,85.21 J7.TIP
N$48
  Top 0.5: U7.1.3V3 25.5,64.5 29.5,60.5 29.5,55 30.5,54 D4.A
N$49
  Top 0.5: D6.A 15.05,86.95 18.4,83.6 U9.4.TAB U9.2 C16.1
N$51  (via drill 0.5)
  Top 0.5: v19.5,36 D5.A
  Bottom 0.5: U2.1.3V3 19,35.5 v19.5,36
PB0  (1 unrouted)
PB1  (1 unrouted)
PB2  (1 unrouted)
PC0  (1 unrouted)
PC1  (1 unrouted)
PC2  (1 unrouted)
PC3  (1 unrouted)
PD2  (1 unrouted)
PD3  (1 unrouted)
PD4  (2 unrouted)
PD4-CAP  (3 unrouted)
  Bottom 0.5: B4.3.B B4.4.B
PD5  (1 unrouted)
PD6  (1 unrouted)
PD7  (1 unrouted)
RA2  (2 unrouted)
  Top 0.5: R3.1 51,33.5 52.41,34.91 U3.17
RA4  (3 unrouted)
RA5  (via drill 0.5)  (2 unrouted)
  Top 0.5: R2.1 v47,25.5 | v49.5,26 48,27.5 48,36.5 47.05,37.45 U3.2
  Bottom 0.5: v47,25.5 47.5,26 v49.5,26
RB5  (3 unrouted)
RB7  (2 unrouted)
  Top 0.5: R12.1 32.5,21.14 U5.10.L
RC0  (3 unrouted)
RC1  (3 unrouted)
RC2  (3 unrouted)
RC3  (3 unrouted)
RC4  (2 unrouted)
  Top 0.5: U2.3.RXI 20.92,26.92 26.3,32.3 U5.6.L
RC5  (2 unrouted)
  Top 0.5: U2.4.RDO 17.62,24.38 16.5,25.5 16.5,32.5 17.5,33.5 21,33.5 22.34,34.84 U5.5.L
RC6  (2 unrouted)
  Top 0.5: R1.1 49,25 47,27 47,29 46.17,29.82 U3.8
RC7  (3 unrouted)
  Bottom 0.406: 45.34,10.16 U1.2
SCL  (6 unrouted)
SDA  (6 unrouted)
VDD  (via drill 0.5, 1.1)  (24 unrouted)
  Top 0.406: v85.9,28.72 v85.9,31.26 v85.9,33.8 v85.9,36.34 v85.9,38.88 v85.9,41.42 v85.9,43.96 v85.9,46.5 v85.9,49.04 v85.9,51.58 v85.9,54.12 v85.9,56.66 v85.9,59.2 v85.9,61.74 v85.9,64.28 v85.9,66.82 v85.9,74.44 85.9,76.9 93.88,84.88 U4.2
  Top 0.5: J1.2 7.54,40.54 8.5,41.5 14.95,41.5 C20.1 C21.1 R15.1 20,43 22,45 U5.1.L | R4.1 R8.1 v26.5,21.5 | LED1.4 51.9,16.9 53,18 C3.1
  Bottom 0.406: v85.9,28.72 85.9,25.6
  Bottom 0.5: v26.5,21.5 22.5,17.5 16.5,17.5 7.54,26.46 J1.2
  other vias: 85.9,71.9 85.9,69.36
XTAL1
  Top 0.25: C7.2 59.3,62.3 XTAL1.3
  Top 0.3: XTAL1.3 60,63.1 60.5,63.6 60.5,65.3 59.9,65.9 56.7,65.9 56,66.6 U6.7
XTAL2
  Top 0.25: C8.2 61.8,64.6 61.45,64.95
  Top 0.3: U6.8 56.8,66.8 57.1,66.5 60.3,66.5 61.2,65.6 61.2,65.2 61.45,64.95 XTAL1.1 61.8,64.8

### Text on the board
tPlace: RESET | VDD | GND | PD4 | ATmega328 | PIC16F1829 | 5V | 3V3 | VDD | GND | HELLO WORLD! | RESET | RB7